# Altium schematic sheet Power_Diagram.SchDoc
size A; SheetNumber: 2; SheetTotal: 2
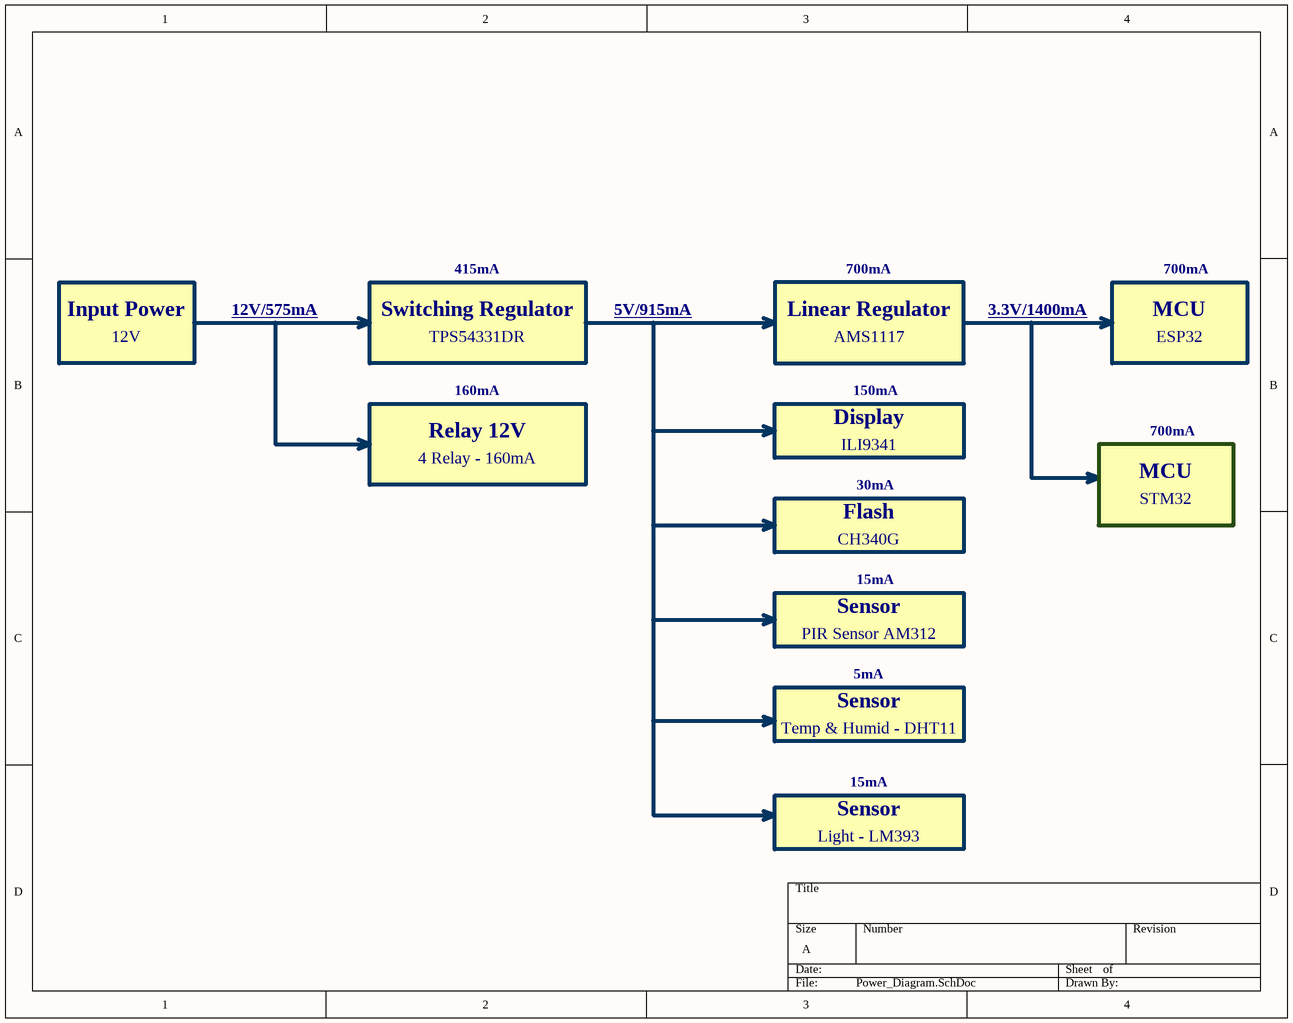
[diagram p0: Power_Diagram.SchDoc]

## Notes on the sheet
- 415mA
- 700mA
- Input Power
- 12V
- 12V/575mA
- TPS54331DR
- Switching Regulator
- 5V/915mA
- Linear Regulator
- AMS1117
- 3.3V/1400mA
- MCU
- ESP32
- Relay 12V
- 160mA
- Display
- 150mA
- 4 Relay - 160mA
- ILI9341
- Flash
- 30mA
- STM32
- CH340G
- Sensor
- PIR Sensor AM312
- 15mA
- 5mA
- Temp & Humid - DHT11
- Light - LM393